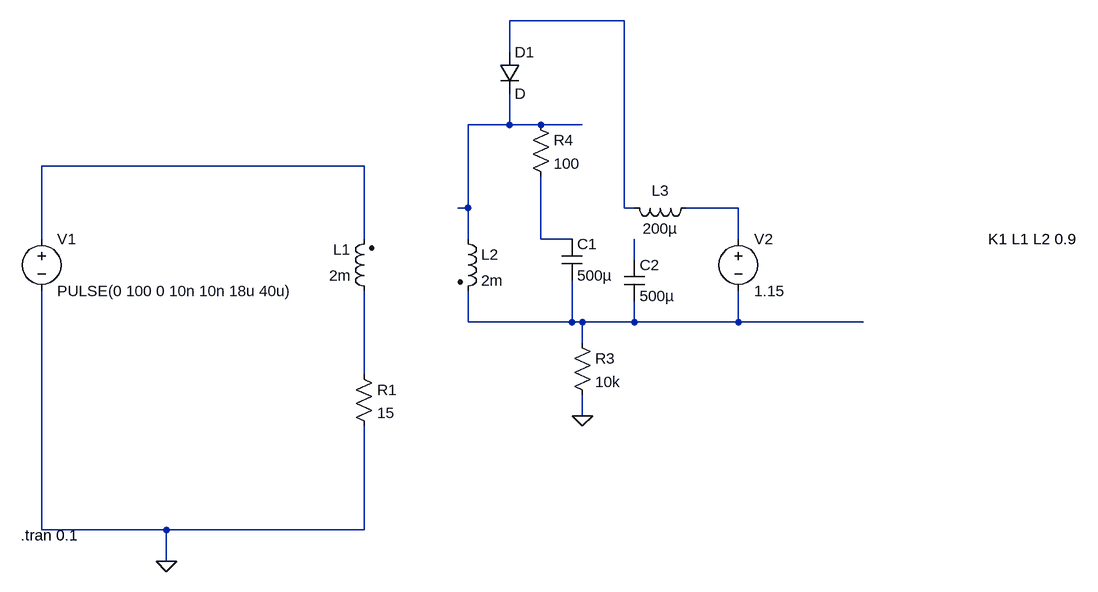
[diagram p0: schematic saturable_inductor.asc]
saturable_inductor.asc, the LTspice schematic file:
Version 4
SHEET 1 1396 708
WIRE 688 -240 512 -240
WIRE 512 -192 512 -240
WIRE 512 -80 512 -128
WIRE 512 -80 448 -80
WIRE 560 -80 512 -80
WIRE 624 -80 560 -80
WIRE 288 -16 -208 -16
WIRE 448 48 448 -80
WIRE 448 48 432 48
WIRE 688 48 688 -240
WIRE 704 48 688 48
WIRE 864 48 784 48
WIRE -208 96 -208 -16
WIRE 288 96 288 -16
WIRE 448 96 448 48
WIRE 560 96 560 0
WIRE 608 96 560 96
WIRE 864 96 864 48
WIRE 704 128 704 96
WIRE 448 224 448 176
WIRE 608 224 608 160
WIRE 608 224 448 224
WIRE 624 224 608 224
WIRE 704 224 704 192
WIRE 704 224 624 224
WIRE 864 224 864 176
WIRE 864 224 704 224
WIRE 1056 224 864 224
WIRE 624 256 624 224
WIRE 288 304 288 176
WIRE 624 368 624 336
WIRE -208 544 -208 176
WIRE -16 544 -208 544
WIRE 288 544 288 384
WIRE 288 544 -16 544
WIRE -16 592 -16 544
FLAG -16 592 0
FLAG 624 368 0
SYMBOL ind2 304 192 R180
WINDOW 0 36 80 Left 2
WINDOW 3 36 40 Left 2
SYMATTR InstName L1
SYMATTR Value 2m
SYMATTR Type ind
SYMBOL ind2 432 80 R0
SYMATTR InstName L2
SYMATTR Value 2m
SYMATTR Type ind
SYMATTR SpiceLine Rser=0.1
SYMBOL voltage -208 80 R0
WINDOW 123 0 0 Left 0
WINDOW 39 0 0 Left 0
SYMATTR InstName V1
SYMATTR Value PULSE(0 100 0 10n 10n 18u 40u)
SYMBOL res 272 288 R0
SYMATTR InstName R1
SYMATTR Value 15
SYMBOL res 608 240 R0
SYMATTR InstName R3
SYMATTR Value 10k
SYMBOL voltage 864 80 R0
WINDOW 123 0 0 Left 0
WINDOW 39 0 0 Left 0
SYMATTR InstName V2
SYMATTR Value 1.15
SYMBOL cap 592 96 R0
SYMATTR InstName C1
SYMATTR Value 500µ
SYMBOL ind 800 32 R90
WINDOW 0 5 56 VBottom 2
WINDOW 3 32 56 VTop 2
SYMATTR InstName L3
SYMATTR Value 200µ
SYMBOL res 544 -96 R0
SYMATTR InstName R4
SYMATTR Value 100
SYMBOL cap 688 128 R0
SYMATTR InstName C2
SYMATTR Value 500µ
SYMBOL diode 496 -192 R0
SYMATTR InstName D1
TEXT 1248 96 Left 2 !K1 L1 L2 0.9
TEXT -240 552 Left 2 !.tran 0.1

The netlist it stands for:
* saturable_inductor.asc
L1 N008 N003 2m
L2 N002 N007 2m Rser=0.1
V1 N003 0 PULSE(0 100 0 10n 10n 18u 40u)
R1 N008 0 15
R3 N007 0 10k
V2 N004 N007 1.15
C1 N005 N007 500µ
L3 N004 N001 200µ
R4 N002 N005 100
C2 N006 N007 500µ
D1 N001 N002 D
.model D D
.lib standard.dio
K1 L1 L2 0.9
.tran 0.1
.backanno
.end